# Altium schematic sheet Block Diagram.SchDoc
size A; SheetNumber: 1; SheetTotal: 7
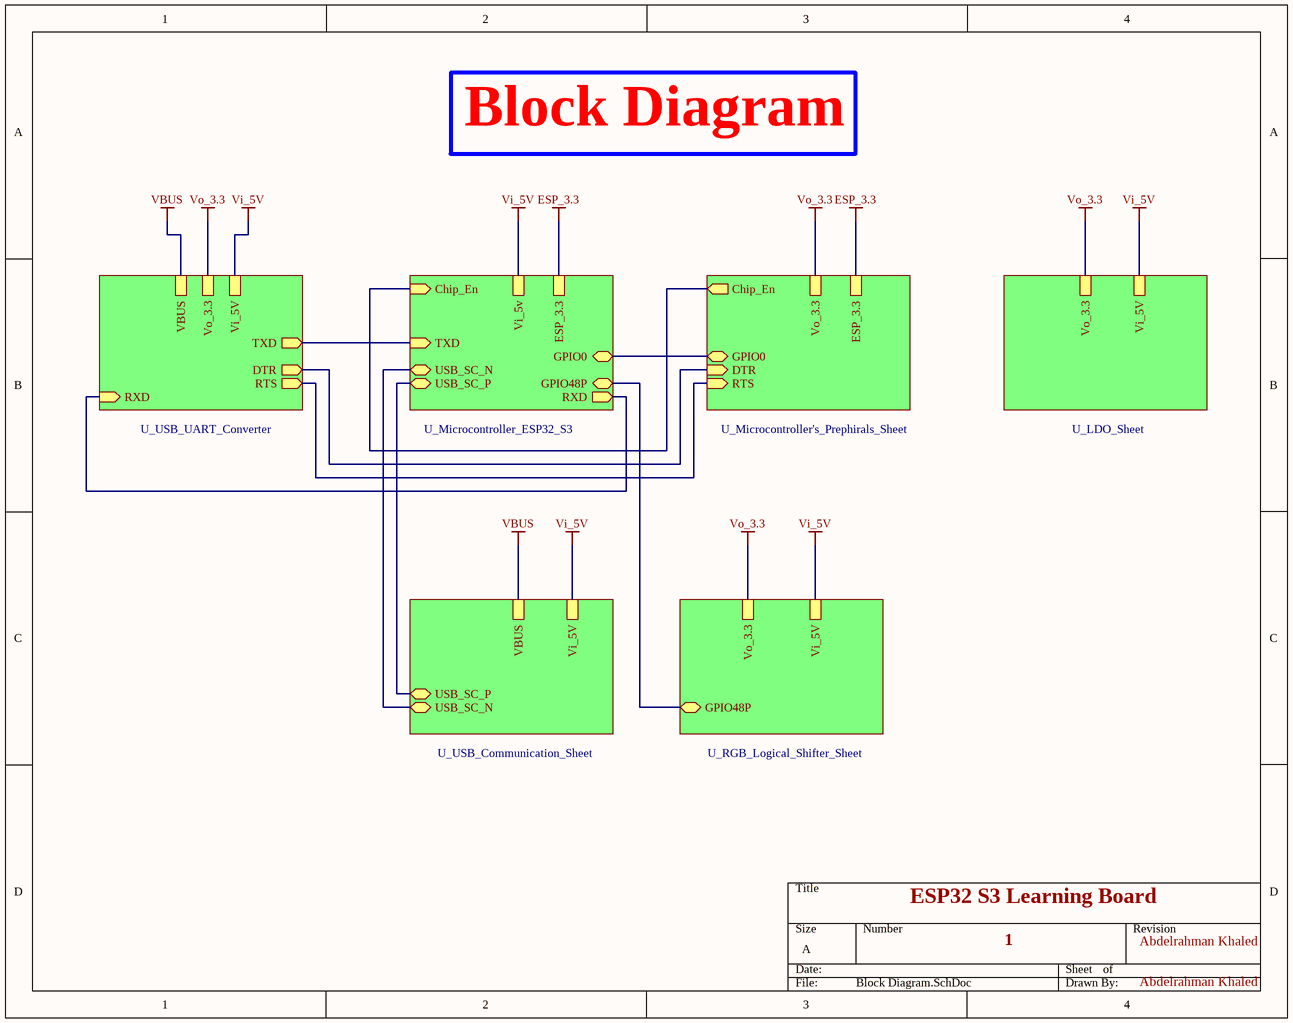
[diagram p0: Block Diagram.SchDoc]

## Sub-sheets
U_LDO_Sheet = LDO_Sheet.SchDoc: Vi_5V, Vo_3.3
U_Microcontroller's_Prephirals_Sheet = Microcontroller's_Prephirals_Sheet.SchDoc: DTR (in), RTS (in), Chip_En (out), GPIO0 (bidir), Vo_3.3, ESP_3.3
U_Microcontroller_ESP32_S3 = Microcontroller_ESP32_S3.SchDoc: Chip_En (in), ESP_3.3, GPIO0 (bidir), GPIO48P (bidir), TXD (in), RXD (out), USB_SC_P (bidir), USB_SC_N (bidir), Vi_5v
U_RGB_Logical_Shifter_Sheet = RGB_Logical_Shifter_Sheet.SchDoc: Vi_5V, Vo_3.3, GPIO48P (bidir)
U_USB_Communication_Sheet = USB_Communication_Sheet.SchDoc: USB_SC_P (bidir), USB_SC_N (bidir), Vi_5V, VBUS
U_USB_UART_Converter = USB_UART_Converter.SchDoc: RTS (out), RXD (in), TXD (out), DTR (out), Vi_5V, Vo_3.3, VBUS

## Nets
ESP_3.3: sheet U_Microcontroller's_Prephirals_Sheet/ESP_3.3, sheet U_Microcontroller_ESP32_S3/ESP_3.3
VBUS: sheet U_USB_Communication_Sheet/VBUS, sheet U_USB_UART_Converter/VBUS
Vi_5V: sheet U_LDO_Sheet/Vi_5V, sheet U_Microcontroller_ESP32_S3/Vi_5v, sheet U_RGB_Logical_Shifter_Sheet/Vi_5V, sheet U_USB_Communication_Sheet/Vi_5V, sheet U_USB_UART_Converter/Vi_5V
Vo_3.3: sheet U_LDO_Sheet/Vo_3.3, sheet U_Microcontroller's_Prephirals_Sheet/Vo_3.3, sheet U_RGB_Logical_Shifter_Sheet/Vo_3.3, sheet U_USB_UART_Converter/Vo_3.3
(unnamed): sheet U_Microcontroller's_Prephirals_Sheet/DTR, sheet U_USB_UART_Converter/DTR
(unnamed): sheet U_Microcontroller's_Prephirals_Sheet/RTS, sheet U_USB_UART_Converter/RTS
(unnamed): sheet U_Microcontroller's_Prephirals_Sheet/Chip_En, sheet U_Microcontroller_ESP32_S3/Chip_En
(unnamed): sheet U_Microcontroller's_Prephirals_Sheet/GPIO0, sheet U_Microcontroller_ESP32_S3/GPIO0
(unnamed): sheet U_Microcontroller_ESP32_S3/GPIO48P, sheet U_RGB_Logical_Shifter_Sheet/GPIO48P
(unnamed): sheet U_Microcontroller_ESP32_S3/TXD, sheet U_USB_UART_Converter/TXD
(unnamed): sheet U_Microcontroller_ESP32_S3/RXD, sheet U_USB_UART_Converter/RXD
(unnamed): sheet U_Microcontroller_ESP32_S3/USB_SC_P, sheet U_USB_Communication_Sheet/USB_SC_P
(unnamed): sheet U_Microcontroller_ESP32_S3/USB_SC_N, sheet U_USB_Communication_Sheet/USB_SC_N

## Notes on the sheet
- Block Diagram
- ESP32 S3 Learning Board
- 1
- Abdelrahman Khaled